# Altium schematic sheet CompensationRegression.SchDoc (part 1 of 2)
size 381 x 241 mm; SheetNumber: 1; SheetTotal: 1; SPICEModelCacheRULBCAFH: <root> / <DocumentId>RULBCAFH</DocumentId> / <CacheFrame Number="0"> / <Model Name="hpa_comphys" Kind="CKT"> / <Text>*$ / .SUBCKT HPA_COMPHYS INP INN OUT_OUT VDD VSS VHYS / EVMID VMID 0 VALUE = { ( V(VDD) + V(VSS) )/2 } / EVH VH 0 VALUE = { ( V(VHYS)/2) } / EINNNEW INNNEW 0 VALUE = { IF( ( V(OUT_OUT) &lt; V(VMID) ),(V(INN) + (V(VH))),( V(INN) - V(VH) ) ) } / EOUT OUT 0 VALUE = { IF( ( V(INP) &gt; V(INNNEW) ), V(VDD), V(VSS) ) } / R1 OUT OUT_OUT 1 / C1 OUT_OUT 0 1e-12 / .ENDS</Text> / </Model> / <Model Name="output_stage_smid" Kind="CKT"> / <Text>*$ / .subckt Output_Stage_SMID 1 2 3 4 / S_SMID         3 4 1 2 _SMID / RS_SMID         1 2 1G / .MODEL         _SMID VSWITCH Roff=1e12 Ron=1.0 Voff=1 Von=0 / .ends Output_Stage_SMID</Text> / </Model> / <Model Name="orgate" Kind="CKT"> / <Text>*$ / .SUBCKT ORGATE 1 2 3 VDD VSS / E1 4 0 VALUE = { IF( ((V(1)&lt; (V(VDD)+V(VSS))/2 ) &amp; (V(2)&lt; (V(VDD)+V(VSS))/2 )), V(VSS), V(VDD) ) } / R1 4 3 1 / C1 3 0 1e-12 / .ENDS</Text> / </Model> / <Model Name="diglevshift" Kind="CKT"> / <Text>*$ / .SUBCKT DIGLEVSHIFT 1 2 VDD_OLD VSS_OLD VDD_NEW VSS_NEW / *E1 3 0 VALUE = { IF( V(1) &lt; (V(VDD_OLD)+V(VSS_OLD))/2, V(VSS_NEW), V(VDD_NEW) ) } / E1 3 0 VALUE = { IF( V(1) &lt; 1, V(VSS_NEW), V(VDD_NEW) ) } / *$ / R1 3 2 1 / *C1 2 0 1e-12 / .ENDS</Text> / </Model> / <Model Name="4orgate" Kind="CKT"> / <Text>*$ / .SUBCKT 4ORGATE 1 2 3 4 5 VDD VSS / E1 6 0 VALUE = { IF( ((V(1)&gt; (V(VDD)+V(VSS))/2 ) ¦ (V(2)&gt; (V(VDD)+V(VSS))/2 ) ¦ (V(3)&gt; (V(VDD)+V(VSS))/2 ) ¦ (V(4)&gt; (V(VDD)+V(VSS))/2 )), V(VDD), V(VSS) ) } / R1 5 6 1 / .ENDS</Text> / </Model> / <Model Name="mid_supply" Kind="CKT"> / <Text>*$ / .SUBCKT MID_SUPPLY OUT VDD VSS / EVMID VMID 0 VALUE = { ( V(VDD) + V(VSS) )/2 } / EOUT OUT 0 VALUE = {V(VMID)} / .ENDS</Text> / </Model> / <Model Name="output_stage_shiz" Kind="CKT"> / <Text>*$ / .subckt Output_Stage_SHIZ 1 2 3 4 / S_SHIZ         3 4 1 2 _SHIZ / RS_SHIZ         1 2 1G / .MODEL         _SHIZ VSWITCH Roff=1e12 Ron=1.0 Voff=1 Von=0 / .ends Output_Stage_SHIZ</Text> / </Model> / <Model Name="inverter" Kind="CKT"> / <Text>*$ / .SUBCKT INVERTER 1 2 VDD VSS / E2 2 0 VALUE = { IF( V(1)&gt; (V(VDD)+V(VSS))/2, V(VSS), V(VDD) ) } / C1 1 0 1e-12 / .ENDS</Text> / </Model> / <Model Name="output_stage_svoh" Kind="CKT"> / <Text>*$ / .subckt Output_Stage_SVOH 1 2 3 4 / S_SVOH         3 4 1 2 _SVOH / RS_SVOH         1 2 1G / .MODEL         _SVOH VSWITCH Roff=1e12 Ron=1.0 Voff=0 Von=1 / .ends Output_Stage_SVOH</Text> / </Model> / <Model Name="output_stage_svol" Kind="CKT"> / <Text>*$ / .subckt Output_Stage_SVOL 1 2 3 4 / S_SVOL         3 4 1 2 _SVOL / RS_SVOL         1 2 1G / .MODEL         _SVOL VSWITCH Roff=1e12 Ron=1.0 Voff=1 Von=0 / .ends Output_Stage_SVOL</Text> / </Model> / <Model Name="andgate" Kind="CKT"> / <Text>*$ / .SUBCKT ANDGATE 1 2 3 VDD VSS / E1 4 0 VALUE = { IF( ((V(1)&gt; (V(VDD)+V(VSS))/2 ) &amp; (V(2)&gt; (V(VDD)+V(VSS))/2 )), V(VDD), V(VSS) ) } / R1 4 3 1 / C1 3 0 1e-12 / .ENDS</Text> / </Model> / <Model Name="output_stage" Kind="CKT"> / <Text>*$ / .SUBCKT Output_Stage EN IN_RANGE POR SHDN_CTRL V+ V+_BUFFER V- V-_BUFFER VIN / +  VOUT / X_SMID    CONTROL_MID 0 N778484 MID Output_Stage_SMID / X_U3         VIN DS_OUT V+_BUFFER V-_BUFFER V+ VSS_NEW DIGLEVSHIFT / X_U7         MID V+_BUFFER V-_BUFFER MID_SUPPLY / V_VLOGIC         1V 0 1 / V_V1         V+ VSS_NEW 1 / X_SHIZ    CONTROL_HIZ 0 N778484 N778496 Output_Stage_SHIZ / X_U8          POR IN_RANGE EN EN CONTROL_HIZ 1V 0 4ORGATE / X_U9         CONTROL_HIZ N789513 1V 0 INVERTER / X_U10         N789513 POR CONTROL_MID 1V 0 ORGATE / L_L1         N778484 VOUT  1n / C_COUTH         VOUT V+  9p   TC=0,0 / C_COUTL         V- VOUT  9p  TC=0,0 / X_SVOH    SOUT_CTRL VSS_NEW N8491902 V+ Output_Stage_SVOH / X_SVOL    SOUT_CTRL VSS_NEW V- N850209 Output_Stage_SVOL / R_ROUTH         N778496 N8491902  60 TC=0,0 / R_ROUTL         N850209 N778496  60 TC=0,0 / E_E1         N855577 VSS_NEW SHDN_CTRL 0 1 / X_U11         N855577 DS_OUT SOUT_CTRL V+ VSS_NEW ANDGATE / .ENDS</Text> / <Dependency>0\output_stage_smid</Dependency> / <Dependency>0\orgate</Dependency> / <Dependency>0\diglevshift</Dependency> / <Dependency>0\4orgate</Dependency> / <Dependency>0\mid_supply</Dependency> / <Dependency>0\output_stage_shiz</Dependency> / <Dependency>0\inverter</Dependency> / <Dependency>0\output_stage_svoh</Dependency> / <Dependency>0\output_stage_svol</Dependency> / <Dependency>0\andgate</Dependency> / </Model> / <Model Name="prop_delay" Kind="CKT"> / <Text>*$ / .SUBCKT Prop_Delay VIN VOUT / T_TPD         N03175 0 VOUT 0 Z0=50 TD=4.5n / R_RT         0 VOUT  50 TC=0,0 / R_RS         N03175 VIN  50 TC=0,0 / .ENDS</Text> / </Model> / <Model Name="vinrange_393" Kind="CKT"> / <Text>*$ / .SUBCKT VINRANGE_393 1 2 OUT VDD VSS / EOUT OUT2 0 VALUE = { IF( ( V(1) &gt;= V(2) ), V(VSS), V(VDD) ) } / R1 OUT2 OUT 1 / C1 OUT 0 1e-12 / .ENDS</Text> / </Model> / <Model Name="inputrange" Kind="CKT"> / <Text>*$ / .SUBCKT INPUTRANGE INN INP INRANGE V+_BUFFER V-_BUFFER / V_VCMNP         N20415 V-_BUFFER -0.21 / V_VCMPN         N202710 V+_BUFFER 0.21 / X_U1         N20155 INP N20826 V+_BUFFER V-_BUFFER VINRANGE_393 / V_VCMPP         N20155 V+_BUFFER 0.21 / V_VCMNN         N20539 V-_BUFFER -0.21 / X_U21         N202710 INN N20833 V+_BUFFER V-_BUFFER VINRANGE_393 / X_U22         INP N20415 N20840 V+_BUFFER V-_BUFFER VINRANGE_393 / X_U23         INN N20539 N20531 V+_BUFFER V-_BUFFER VINRANGE_393 / X_U24         N20826 N20833 N20840 N20531 INRANGE V+_BUFFER V-_BUFFER 4ORGATE / .ENDS</Text> / <Dependency>0\4orgate</Dependency> / <Dependency>0\vinrange_393</Dependency> / </Model> / <Model Name="vcc_range" Kind="CKT"> / <Text>*$ / .SUBCKT VCC_Range 1 2 OUT VDD VSS / EOUT OUT2 0 VALUE = { IF( ( V(1) &gt;= V(2) ), V(VDD), V(VSS) ) } / R1 OUT OUT2 1 / C1 OUT 0 1e-12 / .ENDS</Text> / </Model> / <Model Name="difference" Kind="CKT"> / <Text>*$ / .SUBCKT Difference 1 2 OUT VDD VSS / EOUT OUT1 0 VALUE = { V(1)- V(2)} / R1 OUT1 OUT 1 / *C1 OUT 0 1e-12 / .ENDS</Text> / </Model> / <Model Name="supply_enable" Kind="CKT"> / <Text>*$ / .SUBCKT Supply_Enable EN POR V+_BUFFER V-_BUFFER / X_U5         N16973 N20377 N777375 1V 0 VCC_Range / X_U15         N20310 N16973 POR 1V 0 VCC_Range / X_U13         V+_BUFFER V-_BUFFER N16973 1V 0 Difference / V_VS_MIN_SET         N20310 0 2.19 / V_VS_MAX_SET         N20377 V-_BUFFER 5.5 / V_VLOGIC         1V 0 1 / X_U16         N777122 N16973 N777182 1V 0 VCC_Range / V_VS_MIN_SET1         N777122 V-_BUFFER 2.19 / X_U17         N777375 N777182 EN 1V 0 ORGATE / .ENDS</Text> / <Dependency>0\vcc_range</Dependency> / <Dependency>0\difference</Dependency> / <Dependency>0\orgate</Dependency> / </Model> / <Model Name="supply_buffer1" Kind="CKT"> / <Text>*$ / .SUBCKT SUPPLY_BUFFER1 1 2 VDD_NEW VSS_NEW / EVDD_NEW VDD_NEW 0 VALUE = {V(1)} / EVSS_NEW VSS_NEW 0 VALUE = {V(2)} / .ENDS</Text> / </Model> / <Model Name="supply_buffer" Kind="CKT"> / <Text>*$ / .SUBCKT Supply_Buffer V+ V+_BUFFER V- V-_BUFFER / X_U1         V+ V- V+_BUFFER V-_BUFFER SUPPLY_BUFFER1 / .ENDS</Text> / <Dependency>0\supply_buffer1</Dependency> / </Model> / <Model Name="input_buffer" Kind="CKT"> / <Text>*$ / .SUBCKT Input_Buffer IN+ IN+_BUFF IN- IN-_BUFF / X_U1         IN+ IN- IN+_BUFF IN-_BUFF SUPPLY_BUFFER1 / .ENDS</Text> / <Dependency>0\supply_buffer1</Dependency> / </Model> / <Model Name="top_level_s1" Kind="CKT"> / <Text>*$ / .subckt Top_Level_S1 1 2 3 4 / S_S1         3 4 1 2 _S1 / RS_S1         1 2 1G / .MODEL         _S1 VSWITCH Roff=1e6 Ron=1.0 Voff=0 Von=1 / .ends Top_Level_S1</Text> / </Model> / <Model Name="top_level_s2" Kind="CKT"> / <Text>*$ / .subckt Top_Level_S2 1 2 3 4 / S_S2         3 4 1 2 _S2 / RS_S2         1 2 1G / .MODEL         _S2 VSWITCH Roff=1e6 Ron=1.0 Voff=1 Von=0 / .ends Top_Level_S2</Text> / </Model> / <Model Name="tlv3501" Kind="CKT"> / <Text>* TLV3501 / ***************************************************************************** / * (C) Copyright 2019 Texas Instruments Incorporated. All rights reserved. / ***************************************************************************** / ** This model is designed as an aid for customers of Texas Instruments. / ** TI and its licensors and suppliers make no warranties, either expressed / ** or implied, with respect to this model, including the warranties of / ** merchantability or fitness for a particular purpose.  The model is / ** provided solely on an "as is" basis.  The entire risk as to its quality / ** and performance is with the customer / ***************************************************************************** / * / * This model is subject to change without notice. Texas Instruments / * Incorporated is not responsible for updating this model. / * / ***************************************************************************** / * / * Released by: Texas Instruments Inc. / * Part: TLV3501 / * Date: 07/26/2021 / * Model Type:  TRANSIENT / * Simulator: PSpice / * Simulator Version: 17.4 / * Datasheet: SBOS321E Ã¢â‚¬â€œMARCH 2005Ã¢â‚¬â€œREVISED APRIL 2016 / * / ***************************************************************************** / * / * Updates: / * / * Version 1.0 : Release to Web / *         2.0 : Improving Model Specifications / * / ***************************************************************************** / * Notes: / * The following parameters are modeled: / * Iq, tpd, Ibias, Vcm, Vs, tr, tf, SHDN, Ishdn / * If the input or supply rail goes beyond the abs max limits, the output will float at mid supply / * If one or both inputs go beyond the commmon mode limit, the output will float at mid supply / * If the SHDN pin is above (V+)-0.9V, the comparator is disabled. If the SHDN pin is below (V+)-1.7V, the comparator is enabled. / * Modeled based off of typical EC table specs / ***************************************************************************** / * source TLV3501 / .SUBCKT TLV3501 IN+ IN- SHDN V+ V- OUT / X_U4 N21103 N865822 Prop_Delay / X_U2 IN-BUFF IN+BUFF INRANGE V+_BUFFER V-_BUFFER INPUTRANGE / X_U5 N21237 INRANGE 0 SHDN_CTRL V+ V+_BUFFER V- V-_BUFFER N865822 OUT / +  Output_Stage / X_U6 V+ V+_BUFFER V- V-_BUFFER Supply_Buffer / X_U3         N785573 IN-BUFF N21103 V+_BUFFER V-_BUFFER N852568 HPA_COMPHYS / X_U7 N21237 0 V+_BUFFER V-_BUFFER Supply_Enable / X_U1 IN+ IN+BUFF IN- IN-BUFF Input_Buffer / I_IBP         IN+ V- DC 2p / I_IBN         IN- V- DC 2p / V_VOS         N785573 IN+BUFF 1m / C_CINPL         V- IN+  0.5p  TC=0,0 / C_CINNL         V- IN-  0.5p  TC=0,0 / C_CINPH         IN+ V+  0.5p  TC=0,0 / C_CINNH         IN- V+  0.5p  TC=0,0 / X_U8         SHDN N858114 N858942 V+_BUFFER V-_BUFFER VINRANGE_393 / X_U9         N858423 SHDN N858660 V+_BUFFER V-_BUFFER VINRANGE_393 / V_EN_REF         N858114 V+_BUFFER -1.7 / V_HYST         N852568 0 6m / V_DIS_REF         N858423 V+_BUFFER -0.9 / X_U10         N861616 N861628 SHDN_CTRL 1V 0 ANDGATE / X_U11         N858660 N858664 V+_BUFFER 0 INVERTER / V_VLOGIC         1V 0 1 / T_TPD         N860089 0 N860095 0 Z0=50 TD=100n / R_RT         0 N860095  50 TC=0,0 / R_RS         N860089 N858942  50 TC=0,0 / T_TPD1         N860471 0 N860477 0 Z0=50 TD=30n / R_RS1         N860471 N858664  50 TC=0,0 / R_RT1         0 N860477  50 TC=0,0 / E_E1         N861616 0 N860095 0 2 / E_E2         N861628 0 N860477 0 2 / I_IB_SHDN         SHDN V- DC 2p / G_G1         N880795 V- N880935 0 1 / E_E4         N880765 0 1V SHDN_CTRL 2e-6 / R_RIS         N880795 V+  1u TC=0,0 / E_E3         N880755 0 SHDN_CTRL 0 3.2e-3 / X_S1    SHDN_CTRL 0 N880935 N880755 Top_Level_S1 / X_S2    SHDN_CTRL 0 N880935 N880765 Top_Level_S2 / V_V_LOGIC         N893768 0 1 / R_RIS1         N893768 1V  1u TC=0,0 / .ENDS</Text> / <Dependency>0\hpa_comphys</Dependency> / <Dependency>0\output_stage</Dependency> / <Dependency>0\prop_delay</Dependency> / <Dependency>0\inputrange</Dependency> / <Dependency>0\supply_enable</Dependency> / <Dependency>0\supply_buffer</Dependency> / <Dependency>0\input_buffer</Dependency> / <Dependency>0\vinrange_393</Dependency> / <Dependency>0\andgate</Dependency> / <Dependency>0\inverter</Dependency> / <Dependency>0\top_level_s1</Dependency> / <Dependency>0\top_level_s2</Dependency> / </Model> / <Model Name="block_dc_s7_ina819" Kind="CKT"> / <Text>* / .SUBCKT BLOCK_DC_S7_INA819 1 2 3 4 / .MODEL _S7 VSWITCH (ROFF=1E12 RON=50 VOFF=100M VON=500M) / RS_S7 1 2 1G / S_S7 3 4 1 2 _S7 / .ENDS BLOCK_DC_S7_INA819</Text> / </Model> / <Model Name="block_dc_s1_ina819" Kind="CKT"> / <Text>* / .SUBCKT BLOCK_DC_S1_INA819 1 2 3 4 / .MODEL _S1 VSWITCH (ROFF=1E12 RON=50 VOFF=100M VON=500M) / RS_S1 1 2 1G / S_S1 3 4 1 2 _S1 / .ENDS BLOCK_DC_S1_INA819</Text> / </Model> / <Model Name="block_dc_s5_ina819" Kind="CKT"> / <Text>* / .SUBCKT BLOCK_DC_S5_INA819 1 2 3 4 / .MODEL _S5 VSWITCH (ROFF=1E12 RON=50 VOFF=100M VON=500M) / RS_S5 1 2 1G / S_S5 3 4 1 2 _S5 / .ENDS BLOCK_DC_S5_INA819</Text> / </Model> / <Model Name="block_dc_s8_ina819" Kind="CKT"> / <Text>* / .SUBCKT BLOCK_DC_S8_INA819 1 2 3 4 / .MODEL _S8 VSWITCH (ROFF=1E12 RON=50 VOFF=100M VON=500M) / RS_S8 1 2 1G / S_S8 3 4 1 2 _S8 / .ENDS BLOCK_DC_S8_INA819</Text> / </Model> / <Model Name="block_dc_s6_ina819" Kind="CKT"> / <Text>* / .SUBCKT BLOCK_DC_S6_INA819 1 2 3 4 / .MODEL _S6 VSWITCH (ROFF=1E12 RON=50 VOFF=100M VON=500M) / RS_S6 1 2 1G / S_S6 3 4 1 2 _S6 / .ENDS BLOCK_DC_S6_INA819</Text> / </Model> / <Model Name="block_dc_s9_ina819" Kind="CKT"> / <Text>* / .SUBCKT BLOCK_DC_S9_INA819 1 2 3 4 / .MODEL _S9 VSWITCH (ROFF=1E12 RON=50 VOFF=100M VON=500M) / RS_S9 1 2 1G / S_S9 3 4 1 2 _S9 / .ENDS BLOCK_DC_S9_INA819</Text> / </Model> / <Model Name="block_dc_s10_ina819" Kind="CKT"> / <Text>* / .SUBCKT BLOCK_DC_S10_INA819 1 2 3 4 / .MODEL _S10 VSWITCH (ROFF=1E12 RON=50 VOFF=100M VON=500M) / RS_S10 1 2 1G / S_S10 3 4 1 2 _S10 / .ENDS BLOCK_DC_S10_INA819</Text> / </Model> / <Model Name="block_dc_s11_ina819" Kind="CKT"> / <Text>* / .SUBCKT BLOCK_DC_S11_INA819 1 2 3 4 / .MODEL _S11 VSWITCH (ROFF=1E12 RON=50 VOFF=100M VON=500M) / RS_S11 1 2 1G / S_S11 3 4 1 2 _S11 / .ENDS BLOCK_DC_S11_INA819</Text> / </Model> / <Model Name="block_dc_s12_ina819" Kind="CKT"> / <Text>* / .SUBCKT BLOCK_DC_S12_INA819 1 2 3 4 / .MODEL _S12 VSWITCH (ROFF=1E12 RON=50 VOFF=100M VON=500M) / RS_S12 1 2 1G / S_S12 3 4 1 2 _S12 / .ENDS BLOCK_DC_S12_INA819</Text> / </Model> / <Model Name="block_dc_s13_ina819" Kind="CKT"> / <Text>* / .SUBCKT BLOCK_DC_S13_INA819 1 2 3 4 / .MODEL _S13 VSWITCH (ROFF=1E12 RON=50 VOFF=100M VON=500M) / RS_S13 1 2 1G / S_S13 3 4 1 2 _S13 / .ENDS BLOCK_DC_S13_INA819</Text> / </Model> / <Model Name="block_dc_s14_ina819" Kind="CKT"> / <Text>* / .SUBCKT BLOCK_DC_S14_INA819 1 2 3 4 / .MODEL _S14 VSWITCH (ROFF=1E12 RON=50 VOFF=100M VON=500M) / RS_S14 1 2 1G / S_S14 3 4 1 2 _S14 / .ENDS BLOCK_DC_S14_INA819</Text> / </Model> / <Model Name="block_dc_s15_ina819" Kind="CKT"> / <Text>* / .SUBCKT BLOCK_DC_S15_INA819 1 2 3 4 / .MODEL _S15 VSWITCH (ROFF=1E12 RON=50 VOFF=100M VON=500M) / RS_S15 1 2 1G / S_S15 3 4 1 2 _S15 / .ENDS BLOCK_DC_S15_INA819</Text> / </Model> / <Model Name="a1_in_amp_u1_h1_ina819" Kind="CKT"> / <Text>* / .SUBCKT A1_IN_AMP_U1_H1_INA819 1 2 3 4 / H_U1_H1 3 4 VH_U1_H1 1K / VH_U1_H1 1 2 0V / .ENDS A1_IN_AMP_U1_H1_INA819</Text> / </Model> / <Model Name="vcm_clamp_ina819" Kind="CKT"> / <Text>* / .SUBCKT VCM_CLAMP_INA819 VIN+ VIN- IOUT- IOUT+ VP+ VP- PARAMS: GAIN=1 / G1 IOUT+ IOUT- VALUE={LIMIT(GAIN*V(VIN+,VIN-),V(VP-,VIN-),V(VP+,VIN-))} / .ENDS VCM_CLAMP_INA819</Text> / </Model> / <Model Name="iq_src_ina819" Kind="CKT"> / <Text>* / .SUBCKT IQ_SRC_INA819 VC+ VC- IOUT+ IOUT- PARAMS: GAIN=1E-3 / G1 IOUT+ IOUT- VALUE={IF((V(VC+,VC-)&lt;=0),0,GAIN*V(VC+,VC-))} / .ENDS IQ_SRC_INA819</Text> / </Model> / <Model Name="aol_1_ina819" Kind="CKT"> / <Text>* / .SUBCKT AOL_1_INA819 VC+ VC- IOUT+ IOUT- PARAMS: GAIN=1E-4 IPOS=.5 INEG=-.5 / G1 IOUT+ IOUT- VALUE={LIMIT(GAIN*V(VC+,VC-),INEG,IPOS)} / .ENDS AOL_1_INA819</Text> / </Model> / <Model Name="aol_2_in_ina819" Kind="CKT"> / <Text>* / .SUBCKT AOL_2_IN_INA819 VC+ VC- IOUT+ IOUT- PARAMS: GAIN=0.1234 IPOS=10 INEG=-10 / G1 IOUT+ IOUT- VALUE={LIMIT(GAIN*V(VC+,VC-),INEG,IPOS)} / .ENDS AOL_2_IN_INA819</Text> / </Model> / <Model Name="cl_src_ina819" Kind="CKT"> / <Text>* / .SUBCKT CL_SRC_INA819 VC+ VC- IOUT+ IOUT- PARAMS: GAIN=1 IPOS=0.246 INEG=-0.246 / G1 IOUT+ IOUT- VALUE={LIMIT(GAIN*V(VC+,VC-),INEG,IPOS)} / .ENDS CL_SRC_INA819</Text> / </Model> / <Model Name="a2_in_amp_u2_h1_ina819" Kind="CKT"> / <Text>* / .SUBCKT A2_IN_AMP_U2_H1_INA819 1 2 3 4 / H_U2_H1 3 4 VH_U2_H1 1K / VH_U2_H1 1 2 0V / .ENDS A2_IN_AMP_U2_H1_INA819</Text> / </Model> / <Model Name="vnse_ina819" Kind="CKT"> / <Text>* / .SUBCKT VNSE_INA819 1 2 / .PARAM FLW=0.11 / .PARAM GLF={PWR(FLW,0.25)*NLF/1164} / .PARAM NLF=250 / .PARAM NVR=29 / .PARAM RNV={1.184*PWR(NVR,2)} / .MODEL DVN D (KF={PWR(FLW,0.5)/1E11} IS=1.0E-16) / D1 7 0 DVN / D2 8 0 DVN / E1 3 6 7 8 {GLF} / E2 6 4 5 0 10 / E3 1 2 3 4 1 / I1 0 7 10E-3 / I2 0 8 10E-3 / R1 3 0 1E9 / R2 3 0 1E9 / R3 3 6 1E9 / R4 5 0 {RNV} / R5 5 0 {RNV} / R6 3 4 1E9 / R7 4 0 1E9 / .ENDS VNSE_INA819</Text> / </Model> / <Model Name="out_amp_u3_h1_ina819" Kind="CKT"> / <Text>* / .SUBCKT OUT_AMP_U3_H1_INA819 1 2 3 4 / H_U3_H1 3 4 VH_U3_H1 1K / VH_U3_H1 1 2 0V / .ENDS OUT_AMP_U3_H1_INA819</Text> / </Model> / <Model Name="out_amp_u3_h4_ina819" Kind="CKT"> / <Text>* / .SUBCKT OUT_AMP_U3_H4_INA819 1 2 3 4 / H_U3_H4 3 4 VH_U3_H4 -1 / VH_U3_H4 1 2 0V / .ENDS OUT_AMP_U3_H4_INA819</Text> / </Model> / <Model Name="out_amp_u3_h5_ina819" Kind="CKT"> / <Text>* / .SUBCKT OUT_AMP_U3_H5_INA819 1 2 3 4 / H_U3_H5 3 4 VH_U3_H5 1 / VH_U3_H5 1 2 0V / .ENDS OUT_AMP_U3_H5_INA819</Text> / </Model> / <Model Name="out_amp_u3_s3_ina819" Kind="CKT"> / <Text>* / .SUBCKT OUT_AMP_U3_S3_INA819 1 2 3 4 / .MODEL _U3_S3 VSWITCH (ROFF=1E9 RON=10M VOFF=0.0V VON=10MV) / RS_U3_S3 1 2 1G / S_U3_S3 3 4 1 2 _U3_S3 / .ENDS OUT_AMP_U3_S3_INA819</Text> / </Model> / <Model Name="out_amp_u3_s4_ina819" Kind="CKT"> / <Text>* / .SUBCKT OUT_AMP_U3_S4_INA819 1 2 3 4 / .MODEL _U3_S4 VSWITCH (ROFF=1E9 RON=10M VOFF=0.0V VON=10MV) / RS_U3_S4 1 2 1G / S_U3_S4 3 4 1 2 _U3_S4 / .ENDS OUT_AMP_U3_S4_INA819</Text> / </Model> / <Model Name="clawn_ina819" Kind="CKT"> / <Text>* / .SUBCKT CLAWN_INA819 VC+ VC- IOUT+ IOUT- / G1 IOUT+ IOUT- TABLE {(V(VC+,VC-))} =(0, 2E-5)(10, 2.75E-4)(14, 4.46E-4)(15, 6.03E-4)(16, 9.41E-4)(17, 1.52E-3)(17.5, / + 1.92E-3)(18, 2.41E-3) / .ENDS CLAWN_INA819</Text> / </Model> / <Model Name="vos_drift_ina819" Kind="CKT"> / <Text>* / .SUBCKT VOS_DRIFT_INA819 VOS+ VOS- PARAMS: DC=10.09E-06 POL=1 DRIFT=2.5E-6 / E1 VOS+ VOS- VALUE={DC+POL*DRIFT*(TEMP-27)} / .ENDS VOS_DRIFT_INA819</Text> / </Model> / <Model Name="clamp_amp_lo_ina819" Kind="CKT"> / <Text>* / .SUBCKT CLAMP_AMP_LO_INA819 VC+ VC- VIN COM VO+ VO- PARAMS: G=1 / GVO- COM VO- VALUE = {IF(V(VIN,COM)&lt;V(VC-,COM),((V(VC-,COM)-V(VIN,COM))*G),0)} / GVO+ COM VO+ VALUE = {IF(V(VIN,COM)&gt;V(VC+,COM),((V(VIN,COM)-V(VC+,COM))*G),0)} / .ENDS CLAMP_AMP_LO_INA819</Text> / </Model> / <Model Name="clamp_amp_hi_ina819" Kind="CKT"> / <Text>* / .SUBCKT CLAMP_AMP_HI_INA819 VC+ VC- VIN COM VO+ VO- PARAMS: G=10 / GVO- COM VO- VALUE = {IF(V(VIN,COM)&lt;V(VC-,COM),((V(VC-,COM)-V(VIN,COM))*G),0)} / GVO+ COM VO+ VALUE = {IF(V(VIN,COM)&gt;V(VC+,COM),((V(VIN,COM)-V(VC+,COM))*G),0)} / .ENDS CLAMP_AMP_HI_INA819</Text> / </Model> / <Model Name="ol_sense_ina819" Kind="CKT"> / <Text>* / .SUBCKT OL_SENSE_INA819 1 2 3 4 / GSW+ 1 2 VALUE = {IF((V(3,1)&gt;10E-3¦V(4,1)&gt;10E-3),1,0)} / .ENDS OL_SENSE_INA819</Text> / </Model> / <Model Name="clawp_ina819" Kind="CKT"> / <Text>* / .SUBCKT CLAWP_INA819 VC+ VC- IOUT+ IOUT- / G1 IOUT+ IOUT- TABLE {(V(VC+,VC-))} =(0, 1.5E-4)(10, 4.15E-4)(12, 5.6E-4)(13, 7.17E-4)(14, 9.77E-4)(15, 1.25E-3)(16, / + 1.62E-3)(17, 2.19E-3)(17.5, 2.66E-3)(18, 3.46E-3) / .ENDS CLAWP_INA819</Text> / </Model> / <Model Name="gr_src_ina819" Kind="CKT"> / <Text>* / .SUBCKT GR_SRC_INA819 VC+ VC- IOUT+ IOUT- PARAMS: GAIN=1 IPOS=1.18 INEG=-1.18 / G1 IOUT+ IOUT- VALUE={LIMIT(GAIN*V(VC+,VC-),INEG,IPOS)} / .ENDS GR_SRC_INA819</Text> / </Model> / <Model Name="sw_ol_ina819" Kind="CKT"> / <Text>* / .SUBCKT SW_OL_INA819 SW_OL MID CAP_L CAP_R / .MODEL OL_SW VSWITCH (RON=1E-3 ROFF=1E9 VON=900E-3 VOFF=800E-3) / S1 CAP_L CAP_R SW_OL MID OL_SW / .ENDS SW_OL_INA819</Text> / </Model> / <Model Name="vos_drift_in_ina819" Kind="CKT"> / <Text>* / .SUBCKT VOS_DRIFT_IN_INA819 VOS+ VOS- PARAMS: DC=10.09E-06 POL=1 DRIFT=0.4E-6 / E1 VOS+ VOS- VALUE={DC+POL*DRIFT*(TEMP-27)} / .ENDS VOS_DRIFT_IN_INA819</Text> / </Model> / <Model Name="aol_2_ina819" Kind="CKT"> / <Text>* / .SUBCKT AOL_2_INA819 VC+ VC- IOUT+ IOUT- PARAMS: GAIN=0.1234 IPOS=0.59 INEG=-0.59 / G1 IOUT+ IOUT- VALUE={LIMIT(GAIN*V(VC+,VC-),INEG,IPOS)} / .ENDS AOL_2_INA819</Text> / </Model> / <Model Name="zo_src_ina819" Kind="CKT"> / <Text>* / .SUBCKT ZO_SRC_INA819 VC+ VC- IOUT+ IOUT- PARAMS: GAIN=11764.7 IPOS=3.6E3 INEG=-3.6E3 / G1 IOUT+ IOUT- VALUE={LIMIT(GAIN*V(VC+,VC-),INEG,IPOS)} / .ENDS ZO_SRC_INA819</Text> / </Model> / <Model Name="claw_src_ina819" Kind="CKT"> / <Text>* / .SUBCKT CLAW_SRC_INA819 VC+ VC- IOUT+ IOUT- PARAMS: GAIN=1 IPOS=0.123 INEG=-0.123 / G1 IOUT+ IOUT- VALUE={LIMIT(GAIN*V(VC+,VC-),INEG,IPOS)} / .ENDS CLAW_SRC_INA819</Text> / </Model> / <Model Name="gain_sense_ina819" Kind="CKT"> / <Text>* / .SUBCKT GAIN_SENSE_INA819 COM VOUT VIN GAIN / G1 COM GAIN VALUE = {MAX((V(VOUT,COM)/V(VIN,COM))-5,0)} / .ENDS GAIN_SENSE_INA819</Text> / </Model> / <Model Name="vnse_in_ina819" Kind="CKT"> / <Text>* / .SUBCKT VNSE_IN_INA819 1 2 / .PARAM FLW=0.11 / .PARAM GLF={PWR(FLW,0.25)*NLF/1164} / .PARAM NLF=14 / .PARAM NVR=7 / .PARAM RNV={1.184*PWR(NVR,2)} / .MODEL DVN D (KF={PWR(FLW,0.5)/1E11} IS=1.0E-16) / D1 7 0 DVN / D2 8 0 DVN / E1 3 6 7 8 {GLF} / E2 6 4 5 0 10 / E3 1 2 3 4 1 / I1 0 7 10E-3 / I2 0 8 10E-3 / R1 3 0 1E9 / R2 3 0 1E9 / R3 3 6 1E9 / R4 5 0 {RNV} / R5 5 0 {RNV} / R6 3 4 1E9 / R7 4 0 1E9 / .ENDS VNSE_IN_INA819</Text> / </Model> / <Model Name="r_cmrr_ina819" Kind="CKT"> / <Text>* / .SUBCKT R_CMRR_INA819 GAIN COM R1 R2 / ERES R1 1 VALUE = {I(VSENSE)*V(2,COM)} / ETABLE 2 COM TABLE {V(GAIN,COM)} =(0, 0.8)(500, 0.8)(1000, 4.5)(2000, 9)(5000, 22.5) / VSENSE 1 R2 DC 0 / .ENDS R_CMRR_INA819</Text> / </Model> / <Model Name="femt_ina819" Kind="CKT"> / <Text>* / .SUBCKT FEMT_INA819 1 2 / .PARAM FLWF=0.11 / .PARAM GLFF={PWR(FLWF,0.25)*NLFF/1164} / .PARAM NLFF=659 / .PARAM NVRF=130 / .PARAM RNVF={1.184*PWR(NVRF,2)} / .MODEL DVNF D (KF={PWR(FLWF,0.5)/1E11} IS=1.0E-16) / D1 7 0 DVNF / D2 8 0 DVNF / E1 3 6 7 8 {GLFF} / E2 6 4 5 0 10 / G1 1 2 3 4 1E-6 / I1 0 7 10E-3 / I2 0 8 10E-3 / R1 3 0 1E9 / R2 3 0 1E9 / R3 3 6 1E9 / R4 5 0 {RNVF} / R5 5 0 {RNVF} / R6 3 4 1E9 / R7 4 0 1E9 / .ENDS FEMT_INA819</Text> / </Model> / <Model Name="ina819" Kind="CKT"> / <Text>*$ / * INA819 / ***************************************************************************** / * (C) Copyright 2023 Texas Instruments Incorporated. All rights reserved. / ***************************************************************************** / ** This model is designed as an aid for customers of Texas Instruments. / ** TI and its licensors and suppliers make no warranties, either expressed / ** or implied, with respect to this model, including the warranties of / ** merchantability or fitness for a particular purpose.  The model is / ** provided solely on an "as is" basis.  The entire risk as to its quality / ** and performance is with the customer / ***************************************************************************** / * / * This model is subject to change without notice. Texas Instruments / * Incorporated is not responsible for updating this model. / * / ***************************************************************************** / * / ** Released by: Online Design Tools, Texas Instruments Inc. / * Part: INA819 / * Date: 27MAR2023 / * Model Type: Generic (suitable for all analysis types) / * EVM Order Number: N/A / * EVM Users Guide:  N/A / * Datasheet: SBOS959D - DECEMBER 2018 - REVISED APRIL 2022 / * Created with Green-Williams-Lis Op Amp Macro-model Architecture / * / * Model Version: Final 1.2 / * / ***************************************************************************** / * / * Updates: / * / * Final 1.2 / * Updated VCM block in differential amplifier. / * / * Final 1.1 / * 1. Updated PSpice symbol. / * 2. Modified the capacitor(C_C14) value from 1F to 4uF in GND Float-IQ block / *    to resolve the convergence issue in single and asymmetric supply test. / * / * Final 1.0 / * Release to Web. / * / ***************************************************************************** / * Model Usage Notes: / * 1. The following parameters are modeled: / *    a. OPEN-LOOP GAIN AND PHASE VS. FREQUENCY  WITH RL, CL EFFECTS (Aol) / *    b. UNITY GAIN BANDWIDTH (GBW) / *    c. INPUT COMMON-MODE REJECTION RATIO VS. FREQUENCY (CMRR) / *    d. POWER SUPPLY REJECTION RATIO VS. FREQUENCY (PSRR) / *    e. DIFFERENTIAL INPUT IMPEDANCE (Zid) / *    f. COMMON-MODE INPUT IMPEDANCE (Zic) / *    g. OPEN-LOOP OUTPUT IMPEDANCE VS. FREQUENCY (Zo) / *    h. OUTPUT CURRENT THROUGH THE SUPPLY (Iout) / *    i. INPUT VOLTAGE NOISE DENSITY VS. FREQUENCY (en) / *    j. INPUT CURRENT NOISE DENSITY VS. FREQUENCY (in) / *    k. OUTPUT VOLTAGE SWING vs. OUTPUT CURRENT (Vo) / *    l. SHORT-CIRCUIT OUTPUT CURRENT (Isc) / *    m. QUIESCENT CURRENT (Iq) / *    n. SETTLING TIME VS. CAPACITIVE LOAD (ts) / *    o. SLEW RATE (SR) / *    p. SMALL SIGNAL OVERSHOOT VS. CAPACITIVE LOAD / *    q. LARGE SIGNAL RESPONSE / *    r. OVERLOAD RECOVERY TIME (tor) / *    s. INPUT BIAS CURRENT (Ib) / *    t. INPUT OFFSET CURRENT (Ios) / *    u. INPUT OFFSET VOLTAGE (Vos) / *    v. INPUT OFFSET VOLTAGE VS. TEMPERATURE (Vos Drift) / *    w. INPUT COMMON-MODE VOLTAGE RANGE (Vcm) / *    x. INPUT OFFSET VOLTAGE VS. INPUT COMMON-MODE VOLTAGE (Vos vs. Vcm) / *    y. INPUT/OUTPUT ESD CELLS (ESDin, ESDout) / ***************************************************************************** / .SUBCKT INA819 IN+ IN- VCC VEE OUT REF RG+ RG- / ***************************************************************************** / C_C_COM0     N359954 MID 4P / C_C_COM1     MID N360124 4P / C_C_DIFF     N360124 N359954 1P / C_C_F1       N373869 N373721 57F / C_C_F2       REF N375419 1F / C_C4         INP MID 1F / C_C5         INN MID 1F / C_C6         N365868 NODE1 3.5P / C_C7         N365907 NODE2 3.5P / C_C13        0 N370480 1F / C_C14        0 N370348 4U / C_C15        0 N370520 1F / C_U1_C2      MID U1_N920148 35.4F / C_U1_C10     U1_N945870 U1_N945880 15.92N / C_U1_C11     MID U1_N946838 3.316F / C_U1_C21     U1_N918081 MID 1.45U / C_U1_C29     U1_VIMON1 MID 1N / C_U1_C30     MID U1_N955005 15.9F / C_U1_C31     MID U1_N927180 15.9F / C_U1_C32     MID U1_N957771 2.122E-16 / C_U1_C33     MID U1_N959671 2.122E-16 / C_U1_C34     U1_N959635 U1_N960387 1.477E-16 / C_U2_C2      MID U2_N920148 35.4F / C_U2_C10     U2_N945870 U2_N945880 15.92N / C_U2_C11     MID U2_N946838 3.316F / C_U2_C21     U2_N918081 MID 1.46U / C_U2_C29     U2_VIMON2 MID 1N / C_U2_C30     MID U2_N955005 15.9F / C_U2_C31     MID U2_N927180 15.9F / C_U2_C32     MID U2_N957771 2.122E-16 / C_U2_C33     MID U2_N959671 2.122E-16 / C_U2_C34     U2_N959635 U2_N960387 1.477E-16 / C_U3_C_DIFF  U3_N23574 U3_N23567 2P / C_U3_C2      U3_N25921 U3_N25929 227N / C_U3_C3      U3_N27785 U3_N27793 29N / C_U3_C4      U3_N32347 MID 1F / C_U3_C5      U3_CLAMP3 MID 633N / C_U3_C10     U3_N37029 U3_N37037 4.75N / C_U3_C11     MID U3_N39473 6.77F / C_U3_C12     U3_N546017 U3_N39892 1.872E-16 / C_U3_C16     MID U3_N56849 1F / C_U3_C17     MID U3_N57325 1F / C_U3_C18     MID U3_N59747 1F / C_U3_C19     MID U3_N59865 1F / C_U3_C20     MID U3_N65579 1F / C_U3_C21     MID U3_N65697 1F / C_U3_C22     MID U3_N68774 1F / C_U3_C23     U3_N72398 MID 1F / C_U3_C24     MID U3_N72391 1F / C_U3_C25     MID U3_N81574 1P / C_U3_C26     MID U3_N81664 1P / C_U3_C27     MID U3_SW_OL3 1P / C_U3_C28     U3_VCLP3 MID 1N / C_U3_C29     U3_VIMON3 MID 1N / C_U3_C30     U3_VOUT_S3 MID 1N / C_U3_C31     MID U3_N542865 7.96E-17 / C_U3_C32     MID U3_N546055 7.96E-17 / E_E1         N474241 0 N370348 0 1 / E_U3_E2      U3_N158495 MID U3_CL_CLAMP3 MID 1 / E_U3_E3      U3_N161937 MID N373869 MID 1 / G_G1         N365868 RG- INN RG- 1.33M / G_G3         N365907 RG+ INP RG+ 1.33M / G_G18        VCC_B 0 VCC 0 -1 / G_G19        VEE_B 0 VEE 0 -1 / G_G20        N372587 MID INP INN -1 / G_U1_G15     U1_N945870 MID U1_N927180 U1_N234424 -88.496 / G_U1_G16     U1_N946178 MID U1_N945880 MID -18 / G_U1_G17     U1_N946216 MID U1_N946196 MID -1 / G_U1_G54     U1_N920148 MID U1_N918081 MID -1E-6 / G_U1_G55     U1_N955005 MID U1_N920148 MID -1E-6 / G_U1_G56     U1_N927180 MID U1_N955005 MID -1E-6 / G_U1_G57     U1_N957735 MID U1_N957719 MID -1 / G_U1_G58     U1_N959635 MID U1_N959619 MID -1 / G_U1_G59     U1_N960435 MID U1_N960387 MID -9.09091K / G_U2_G15     U2_N945870 MID U2_N927180 U2_N234424 -88.496 / G_U2_G16     U2_N946178 MID U2_N945880 MID -18 / G_U2_G17     U2_N946216 MID U2_N946196 MID -1 / G_U2_G54     U2_N920148 MID U2_N918081 MID -1E-6 / G_U2_G55     U2_N955005 MID U2_N920148 MID -1E-6 / G_U2_G56     U2_N927180 MID U2_N955005 MID -1E-6 / G_U2_G57     U2_N957735 MID U2_N957719 MID -1 / G_U2_G58     U2_N959635 MID U2_N959619 MID -1 / G_U2_G59     U2_N960435 MID U2_N960387 MID -9.09091K / G_U3_G3      U3_N25921 MID VEE_B MID -350M / G_U3_G4      U3_N27785 MID VCC_B MID -912M / G_U3_G5      U3_N28678 U3_N28438 U3_N27793 U3_N25929 -1M / G_U3_G6      U3_VSENSE3 MID U3_CLAMP3 MID -1M / G_U3_G12     U3_CLAW_CLAMP3 MID U3_VSENSE3 MID -1M / G_U3_G13     U3_CL_CLAMP3 MID U3_CLAW_CLAMP3 MID -1M / G_U3_G15     U3_N37029 MID U3_CL_CLAMP3 U3_N45999 -88.5 / G_U3_G16     U3_N39124 MID U3_N37037 MID -6.866 / G_U3_G17     U3_N39920 MID U3_N39417 MID -1 / G_U3_G20     U3_VCC_CLP3 MID U3_N72398 MID -1M / G_U3_G21     U3_VEE_CLP3 MID U3_N72391 MID -1M / G_U3_G24     U3_N542853 MID U3_N542815 MID -1 / G_U3_G25     U3_N546017 MID U3_N546001 MID -1 / G_U3_G26     U3_N1017618 MID U3_N1017606 MID -1 / G_U3_G27     U3_N1017680 MID U3_N1017700 MID -1 / I_I_B        N359958 MID DC 150P / I_I_OS       N360200 MID DC 1F / I_I_Q        VCC VEE DC 350U / I_ISINK1     RG- VEE_B DC 24U / I_ISINK2     RG+ VEE_B DC 24U / R_R1         IN+ N359954 R_NOISELESS 10M / R_R2         IN- N360124 R_NOISELESS 10M / R_R3         N359954 MID R_NOISELESS 1T / R_R4         MID N360124 R_NOISELESS 1T / R_R15        N363177 N359958 R_NOISELESS 1M / R_R16        N364506 N360200 R_NOISELESS 1M / R_R18        MID N363059 R_NOISELESS 1G / R_R19        MID N363261 R_NOISELESS 1G / R_R20        N363141 MID R_NOISELESS 1 / R_R21        INP N363141 R_NOISELESS 1M / R_R22        MID N364388 R_NOISELESS 1G / R_R23        INN N364470 R_NOISELESS 1M / R_R24        N364470 MID R_NOISELESS 1 / R_R25        MID N364590 R_NOISELESS 1G / R_R46        VCC_B 0 R_NOISELESS 1 / R_R47        VCC_B N370480 R_NOISELESS 1M / R_R48        N370480 N370348 R_NOISELESS 1MEG / R_R49        N370348 0 R_NOISELESS 1T / R_R50        N370348 N370520 R_NOISELESS 1MEG / R_R51        N370520 VEE_B R_NOISELESS 1M / R_R52        VEE_B 0 R_NOISELESS 1 / R_R53        N372587 MID R_NOISELESS 1 / R_R54        GAIN_S MID R_NOISELESS 1 / R_R60        N365868 VCC_B 41.67K / R_R61        N365907 VCC_B 41.67K / R_R62        RG+ NODE2 25K / R_R63        RG- NODE1 25K / R_R64        N373721 NODE1 40K / R_R65        N373869 N373721 40K / R_R66        N375419 NODE2 40K / R_R67        N375473 N375419 40K / R_R68        OUT N373869 10M / R_R69        MID N474241 R_NOISELESS 10M / R_U1_R34     U1_N945880 U1_N945870 R_NOISELESS 100MEG / R_U1_R35     MID U1_N945870 R_NOISELESS 1 / R_U1_R36     MID U1_N945880 R_NOISELESS 5.882MEG / R_U1_R38     U1_N946196 U1_N946178 R_NOISELESS 627.3MEG / R_U1_R39     U1_N946838 U1_N946196 R_NOISELESS 100MEG / R_U1_R41     MID U1_N946216 R_NOISELESS 1 / R_U1_R46     MID U1_N946178 R_NOISELESS 1 / R_U1_R67     MID U1_N918063 R_NOISELESS 1E6 / R_U1_R68     MID U1_N918081 R_NOISELESS 1E6 / R_U1_R135    U1_N920148 MID R_NOISELESS 1E6 / R_U1_R148    U1_N955005 MID R_NOISELESS 1E6 / R_U1_R149    U1_N927180 MID R_NOISELESS 1E6 / R_U1_R150    U1_N957719 U1_N946216 R_NOISELESS 271.3MEG / R_U1_R151    U1_N957771 U1_N957719 R_NOISELESS 100MEG / R_U1_R152    MID U1_N957735 R_NOISELESS 1 / R_U1_R153    U1_N959619 U1_N957735 R_NOISELESS 271.3MEG / R_U1_R154    U1_N959671 U1_N959619 R_NOISELESS 100MEG / R_U1_R155    MID U1_N959635 R_NOISELESS 1 / R_U1_R156    U1_N960387 U1_N959635 R_NOISELESS 100MEG / R_U1_R157    MID U1_N960435 R_NOISELESS 1 / R_U1_R158    MID U1_N960387 R_NOISELESS 11.0012K / R_U1_RDUMMY1 MID U1_N234424 R_NOISELESS 10K / R_U1_RX1     U1_N234424 U1_N960435 R_NOISELESS 100K / R_U1_RX2     U1_VIMON1 U1_N963303 R_NOISELESS 100 / R_U1_RX3     MID U1_N963303 R_NOISELESS 1G / R_U2_R34     U2_N945880 U2_N945870 R_NOISELESS 100MEG / R_U2_R35     MID U2_N945870 R_NOISELESS 1 / R_U2_R36     MID U2_N945880 R_NOISELESS 5.882MEG / R_U2_R38     U2_N946196 U2_N946178 R_NOISELESS 627.3MEG / R_U2_R39     U2_N946838 U2_N946196 R_NOISELESS 100MEG / R_U2_R41     MID U2_N946216 R_NOISELESS 1 / R_U2_R46     MID U2_N946178 R_NOISELESS 1 / R_U2_R67     MID U2_N971041 R_NOISELESS 1E6 / R_U2_R68     MID U2_N918081 R_NOISELESS 1E6 / R_U2_R135    U2_N920148 MID R_NOISELESS 1E6 / R_U2_R148    U2_N955005 MID R_NOISELESS 1E6 / R_U2_R149    U2_N927180 MID R_NOISELESS 1E6 / R_U2_R150    U2_N957719 U2_N946216 R_NOISELESS 271.3MEG / R_U2_R151    U2_N957771 U2_N957719 R_NOISELESS 100MEG / R_U2_R152    MID U2_N957735 R_NOISELESS 1 / R_U2_R153    U2_N959619 U2_N957735 R_NOISELESS 271.3MEG / R_U2_R154    U2_N959671 U2_N959619 R_NOISELESS 100MEG / R_U2_R155    MID U2_N959635 R_NOISELESS 1 / R_U2_R156    U2_N960387 U2_N959635 R_NOISELESS 100MEG / R_U2_R157    MID U2_N960435 R_NOISELESS 1 / R_U2_R158    MID U2_N960387 R_NOISELESS 11.0012K / R_U2_RDUMMY1 MID U2_N234424 R_NOISELESS 10K / R_U2_RX1     U2_N234424 U2_N960435 R_NOISELESS 100K / R_U2_RX2     U2_VIMON2 U2_N963303 R_NOISELESS 100 / R_U2_RX3     MID U2_N963303 R_NOISELESS 1G / R_U3_R1      N375419 U3_N23567 R_NOISELESS 10M / R_U3_R2      N373721 U3_N23574 R_NOISELESS 10M / R_U3_R3      U3_N23567 MID R_NOISELESS 1T / R_U3_R4      MID U3_N23574 R_NOISELESS 1T / R_U3_R9      U3_N25929 U3_N25921 R_NOISELESS 1MEG / R_U3_R10     MID U3_N25921 R_NOISELESS 1 / R_U3_R11     MID U3_N25929 R_NOISELESS 1.42857 / R_U3_R12     U3_N27793 U3_N27785 R_NOISELESS 1MEG / R_U3_R13     MID U3_N27785 R_NOISELESS 1 / R_U3_R14     MID U3_N27793 R_NOISELESS 548M / R_U3_R15     U3_N28438 U3_N25435 R_NOISELESS 1M / R_U3_R16     U3_N28678 U3_N28438 R_NOISELESS 1K / R_U3_R17     U3_N31303 U3_N23574 R_NOISELESS 1M / R_U3_R18     MID U3_N31389 R_NOISELESS 1G / R_U3_R19     MID U3_N31737 R_NOISELESS 1G / R_U3_R20     U3_N32236 MID R_NOISELESS 1 / R_U3_R21     U3_N32347 U3_N32236 R_NOISELESS 1M / R_U3_R22     MID U3_N32510 R_NOISELESS 1MEG / R_U3_R23     MID U3_CLAMP3 R_NOISELESS 1MEG / R_U3_R24     MID U3_VSENSE3 R_NOISELESS 1K / R_U3_R32     MID U3_CLAW_CLAMP3 R_NOISELESS 1K / R_U3_R33     MID U3_CL_CLAMP3 R_NOISELESS 1K / R_U3_R34     U3_N37037 U3_N37029 R_NOISELESS 100MEG / R_U3_R35     MID U3_N37029 R_NOISELESS 1 / R_U3_R36     MID U3_N37037 R_NOISELESS 17.05MEG / R_U3_R37     MID U3_N39124 R_NOISELESS 1 / R_U3_R38     U3_N39417 U3_N39124 R_NOISELESS 147MEG / R_U3_R39     U3_N39473 U3_N39417 R_NOISELESS 100MEG / R_U3_R40     U3_N39892 U3_N546017 R_NOISELESS 100MEG / R_U3_R41     MID U3_N39920 R_NOISELESS 1 / R_U3_R42     MID U3_N39892 R_NOISELESS 8.50072K / R_U3_R43     MID U3_N46041 R_NOISELESS 1 / R_U3_R53     U3_VCC_CLP3 MID R_NOISELESS 1G / R_U3_R54     U3_N55560 MID R_NOISELESS 1 / R_U3_R55     U3_N56849 U3_N55560 R_NOISELESS 1M / R_U3_R56     U3_VEE_CLP3 MID R_NOISELESS 1G / R_U3_R57     U3_N57321 MID R_NOISELESS 1 / R_U3_R58     U3_N57325 U3_N57321 R_NOISELESS 1M / R_U3_R59     U3_N59739 MID R_NOISELESS 1G / R_U3_R60     U3_N59743 MID R_NOISELESS 1 / R_U3_R61     U3_N59747 U3_N59743 R_NOISELESS 1M / R_U3_R62     U3_N59865 U3_N59881 R_NOISELESS 1M / R_U3_R63     U3_N59905 MID R_NOISELESS 1G / R_U3_R64     U3_N59881 MID R_NOISELESS 1 / R_U3_R65     U3_N65567 MID R_NOISELESS 1G / R_U3_R66     U3_N65575 MID R_NOISELESS 1 / R_U3_R67     U3_N65579 U3_N65575 R_NOISELESS 1M / R_U3_R68     U3_N65697 U3_N65713 R_NOISELESS 1M / R_U3_R69     U3_N65737 MID R_NOISELESS 1G / R_U3_R70     U3_N65713 MID R_NOISELESS 1 / R_U3_R71     U3_N68774 U3_VSENSE3 R_NOISELESS 1M / R_U3_R72     VCC_B U3_N72064 R_NOISELESS 1K / R_U3_R73     U3_N72064 U3_N72398 R_NOISELESS 1M / R_U3_R74     U3_N72073 VEE_B R_NOISELESS 1K / R_U3_R75     U3_N72073 U3_N72391 R_NOISELESS 1M / R_U3_R76     MID U3_VCC_CLP3 R_NOISELESS 1K / R_U3_R77     U3_VEE_CLP3 MID R_NOISELESS 1K / R_U3_R80     U3_V11 U3_N81574 R_NOISELESS 100 / R_U3_R81     U3_V12 U3_N81664 R_NOISELESS 100 / R_U3_R82     U3_N81756 MID R_NOISELESS 1 / R_U3_R83     U3_N81756 U3_SW_OL3 R_NOISELESS 100 / R_U3_R84     U3_N158495 U3_VCLP3 R_NOISELESS 100 / R_U3_R85     U3_N542815 U3_N39920 R_NOISELESS 300MEG / R_U3_R86     U3_N542865 U3_N542815 R_NOISELESS 100MEG / R_U3_R87     MID U3_N542853 R_NOISELESS 1 / R_U3_R88     U3_N546001 U3_N542853 R_NOISELESS 300MEG / R_U3_R89     U3_N546055 U3_N546001 R_NOISELESS 100MEG / R_U3_R90     MID U3_N546017 R_NOISELESS 1 / R_U3_R91     U3_N1017618 MID R_NOISELESS 1 / R_U3_R92     U3_N1017680 MID R_NOISELESS 1 / R_U3_RDUMMY_3 MID U3_N45999 R_NOISELESS 10K / R_U3_RX_3    U3_N45999 U3_N46041 R_NOISELESS 100K / R_U3_RX1     MID U3_N161737 R_NOISELESS 1G / R_U3_RX2     U3_VIMON3 U3_N161737 R_NOISELESS 100 / R_U3_RX3     MID U3_N161937 R_NOISELESS 1G / R_U3_RX4     U3_VOUT_S3 U3_N161937 R_NOISELESS 100 / V_U3_V_GRN   U3_N65737 MID -62 / V_U3_V_GRP   U3_N65567 MID 62 / V_U3_V_ISCN  U3_N59905 MID -18 / V_U3_V_ISCP  U3_N59739 MID 18 / V_U3_V_ORN3  U3_N1017606 U3_VCLP3 -450M / V_U3_V_ORP3  U3_N1017700 U3_VCLP3 450M / V_U3_VCM_MAX U3_N31389 VCC_B -1.5 / V_U3_VCM_MIN U3_N31737 VEE_B 0.2 / V_V_OSN      N360200 N360124 0 / V_VB         VCC_B N365895 1 / V_VCM_MAX    N363059 VCC_B -2 / V_VCM_MAX1   N364388 VCC_B -2 / V_VCM_MIN    N363261 VEE_B 2 / V_VCM_MIN1   N364590 VEE_B 2 / X_S1         N359954 VCC N359954 VCC BLOCK_DC_S1_INA819 / X_S5         VEE N359954 VEE N359954 BLOCK_DC_S5_INA819 / X_S6         N360124 VCC N360124 VCC BLOCK_DC_S6_INA819 / X_S7         VEE N360124 VEE N360124 BLOCK_DC_S7_INA819 / X_S8         OUT VCC OUT VCC BLOCK_DC_S8_INA819 / X_S9         VEE OUT VEE OUT BLOCK_DC_S9_INA819 / X_S10        REF VCC REF VCC BLOCK_DC_S10_INA819 / X_S11        VEE REF VEE REF BLOCK_DC_S11_INA819 / X_S12        RG- VCC RG- VCC BLOCK_DC_S12_INA819 / X_S13        VEE RG- VEE RG- BLOCK_DC_S13_INA819 / X_S14        RG+ VCC RG+ VCC BLOCK_DC_S14_INA819 / X_S15        VEE RG+ VEE RG+ BLOCK_DC_S15_INA819 / X_U1_H1      U1_N234424 NODE1 U1_N963303 MID A1_IN_AMP_U1_H1_INA819 / X_U1_U26     U1_VIMON1 MID MID VCC IQ_SRC_INA819 PARAMS: GAIN=1E-3 / X_U1_U27     MID U1_VIMON1 VEE MID IQ_SRC_INA819 PARAMS: GAIN=1E-3 / X_U1_U30     N365895 N365868 MID U1_N918063 AOL_1_INA819 PARAMS: GAIN=1E-4 IPOS=.5 INEG=-.5 / X_U1_U31     U1_N918063 MID MID U1_N918081 AOL_2_IN_INA819 PARAMS: GAIN=0.1234 IPOS=10 INEG=-10 / X_U2_H1      U2_N234424 NODE2 U2_N963303 MID A2_IN_AMP_U2_H1_INA819 / X_U2_U26     U2_VIMON2 MID MID VCC IQ_SRC_INA819 PARAMS: GAIN=1E-3 / X_U2_U27     MID U2_VIMON2 VEE MID IQ_SRC_INA819 PARAMS: GAIN=1E-3 / X_U2_U30     N365895 N365907 MID U2_N971041 AOL_1_INA819 PARAMS: GAIN=1E-4 IPOS=.5 INEG=-.5 / X_U2_U31     U2_N971041 MID MID U2_N918081 AOL_2_IN_INA819 PARAMS: GAIN=0.1234 IPOS=10 INEG=-10 / X_U3_H1      U3_N45999 N373869 U3_N161737 MID OUT_AMP_U3_H1_INA819 / X_U3_H4      U3_N1017338 U3_N1017618 U3_V11 MID OUT_AMP_U3_H4_INA819 / X_U3_H5      U3_N1017378 U3_N1017680 U3_V12 MID OUT_AMP_U3_H5_INA819 / X_U3_S3      U3_N1017338 U3_CLAMP3 U3_N1017338 U3_CLAMP3 OUT_AMP_U3_S3_INA819 / X_U3_S4      U3_CLAMP3 U3_N1017378 U3_CLAMP3 U3_N1017378 OUT_AMP_U3_S4_INA819 / X_U3_U4      U3_N25435 U3_N24207 VOS_DRIFT_INA819 PARAMS: DC=10.09E-06 POL=1 DRIFT=2.5E-6 / X_U3_U6      U3_N28678 MID U3_N32236 MID U3_N31389 U3_N31737 VCM_CLAMP_INA819 PARAMS: GAIN=1 / X_U3_U10     U3_VCC_CLP3 U3_VEE_CLP3 U3_VOUT_S3 MID U3_N55560 U3_N57321 CLAMP_AMP_LO_INA819 PARAMS: G=1 / X_U3_U11     U3_N59739 U3_N59905 U3_VIMON3 MID U3_N59743 U3_N59881 CLAMP_AMP_LO_INA819 PARAMS: G=1 / X_U3_U12     U3_N65567 U3_N65737 U3_N68774 MID U3_N65575 U3_N65713 CLAMP_AMP_HI_INA819 PARAMS: G=10 / X_U3_U17     MID U3_N81756 U3_N81574 U3_N81664 OL_SENSE_INA819 / X_U3_U18     U3_VIMON3 MID U3_N72064 VCC_B CLAWP_INA819 / X_U3_U19     MID U3_VIMON3 VEE_B U3_N72073 CLAWN_INA819 / X_U3_U22     U3_N59747 U3_N59865 U3_CL_CLAMP3 MID CL_SRC_INA819 PARAMS: GAIN=1 IPOS=0.246 INEG=-0.246 / X_U3_U23     U3_N65579 U3_N65697 U3_CLAMP3 MID GR_SRC_INA819 PARAMS: GAIN=1 IPOS=1.18 INEG=-1.18 / X_U3_U25     U3_SW_OL3 MID U3_N37029 U3_N37037 SW_OL_INA819 / X_U3_U26     U3_VIMON3 MID MID VCC IQ_SRC_INA819 PARAMS: GAIN=1E-3 / X_U3_U27     MID U3_VIMON3 VEE MID IQ_SRC_INA819 PARAMS: GAIN=1E-3 / X_U3_U30     U3_N32347 U3_N31303 MID U3_N32510 AOL_1_INA819 PARAMS: GAIN=1E-4 IPOS=.5 INEG=-.5 / X_U3_U31     U3_N32510 MID MID U3_CLAMP3 AOL_2_INA819 PARAMS: GAIN=0.1234 IPOS=0.59 INEG=-0.59 / X_U3_U32     U3_N39892 MID MID U3_N46041 ZO_SRC_INA819 PARAMS: GAIN=11764.7 IPOS=3.6E3 INEG=-3.6E3 / X_U3_U35     U3_N56849 U3_N57325 U3_CLAW_CLAMP3 MID CLAW_SRC_INA819 PARAMS: GAIN=1 IPOS=0.123 INEG=-0.123 / X_U3_U36     U3_N23567 U3_N24207 VNSE_INA819 / X_U4         N359958 N359966 VOS_DRIFT_IN_INA819 PARAMS: DC=10E-06 POL=1 DRIFT=0.4E-6 / X_U6         N363177 MID N363141 MID N363059 N363261 VCM_CLAMP_INA819 PARAMS: GAIN=1 / X_U16        MID OUT N372587 GAIN_S GAIN_SENSE_INA819 / X_U38        N359954 N359966 VNSE_IN_INA819 / X_U39        N364506 MID N364470 MID N364388 N364590 VCM_CLAMP_INA819 PARAMS: GAIN=1 / X_U40        GAIN_S MID N375473 REF R_CMRR_INA819 / X_U41        N359966 MID FEMT_INA819 / X_U42        N360124 MID FEMT_INA819 / .MODEL R_NOISELESS RES (T_ABS=-273.15) / .ENDS INA819</Text> / <Dependency>0\block_dc_s7_ina819</Dependency> / <Dependency>0\block_dc_s1_ina819</Dependency> / <Dependency>0\block_dc_s5_ina819</Dependency> / <Dependency>0\block_dc_s8_ina819</Dependency> / <Dependency>0\block_dc_s6_ina819</Dependency> / <Dependency>0\block_dc_s9_ina819</Dependency> / <Dependency>0\block_dc_s10_ina819</Dependency> / <Dependency>0\block_dc_s11_ina819</Dependency> / <Dependency>0\block_dc_s12_ina819</Dependency> / <Dependency>0\block_dc_s13_ina819</Dependency> / <Dependency>0\block_dc_s14_ina819</Dependency> / <Dependency>0\block_dc_s15_ina819</Dependency> / <Dependency>0\a1_in_amp_u1_h1_ina819</Dependency> / <Dependency>0\vcm_clamp_ina819</Dependency> / <Dependency>0\iq_src_ina819</Dependency> / <Dependency>0\aol_1_ina819</Dependency> / <Dependency>0\aol_2_in_ina819</Dependency> / <Dependency>0\cl_src_ina819</Dependency> / <Dependency>0\a2_in_amp_u2_h1_ina819</Dependency> / <Dependency>0\vnse_ina819</Dependency> / <Dependency>0\out_amp_u3_h1_ina819</Dependency> / <Dependency>0\out_amp_u3_h4_ina819</Dependency> / <Dependency>0\out_amp_u3_h5_ina819</Dependency> / <Dependency>0\out_amp_u3_s3_ina819</Dependency> / <Dependency>0\out_amp_u3_s4_ina819</Dependency> / <Dependency>0\clawn_ina819</Dependency> / <Dependency>0\vos_drift_ina819</Dependency> / <Dependency>0\clamp_amp_lo_ina819</Dependency> / <Dependency>0\clamp_amp_hi_ina819</Dependency> / <Dependency>0\ol_sense_ina819</Dependency> / <Dependency>0\clawp_ina819</Dependency> / <Dependency>0\gr_src_ina819</Dependency> / <Dependency>0\sw_ol_ina819</Dependency> / <Dependency>0\vos_drift_in_ina819</Dependency> / <Dependency>0\aol_2_ina819</Dependency> / <Dependency>0\zo_src_ina819</Dependency> / <Dependency>0\claw_src_ina819</Dependency> / <Dependency>0\gain_sense_ina819</Dependency> / <Dependency>0\vnse_in_ina819</Dependency> / <Dependency>0\r_cmrr_ina819</Dependency> / <Dependency>0\femt_ina819</Dependency> / </Model> / </CacheFrame> / </root>
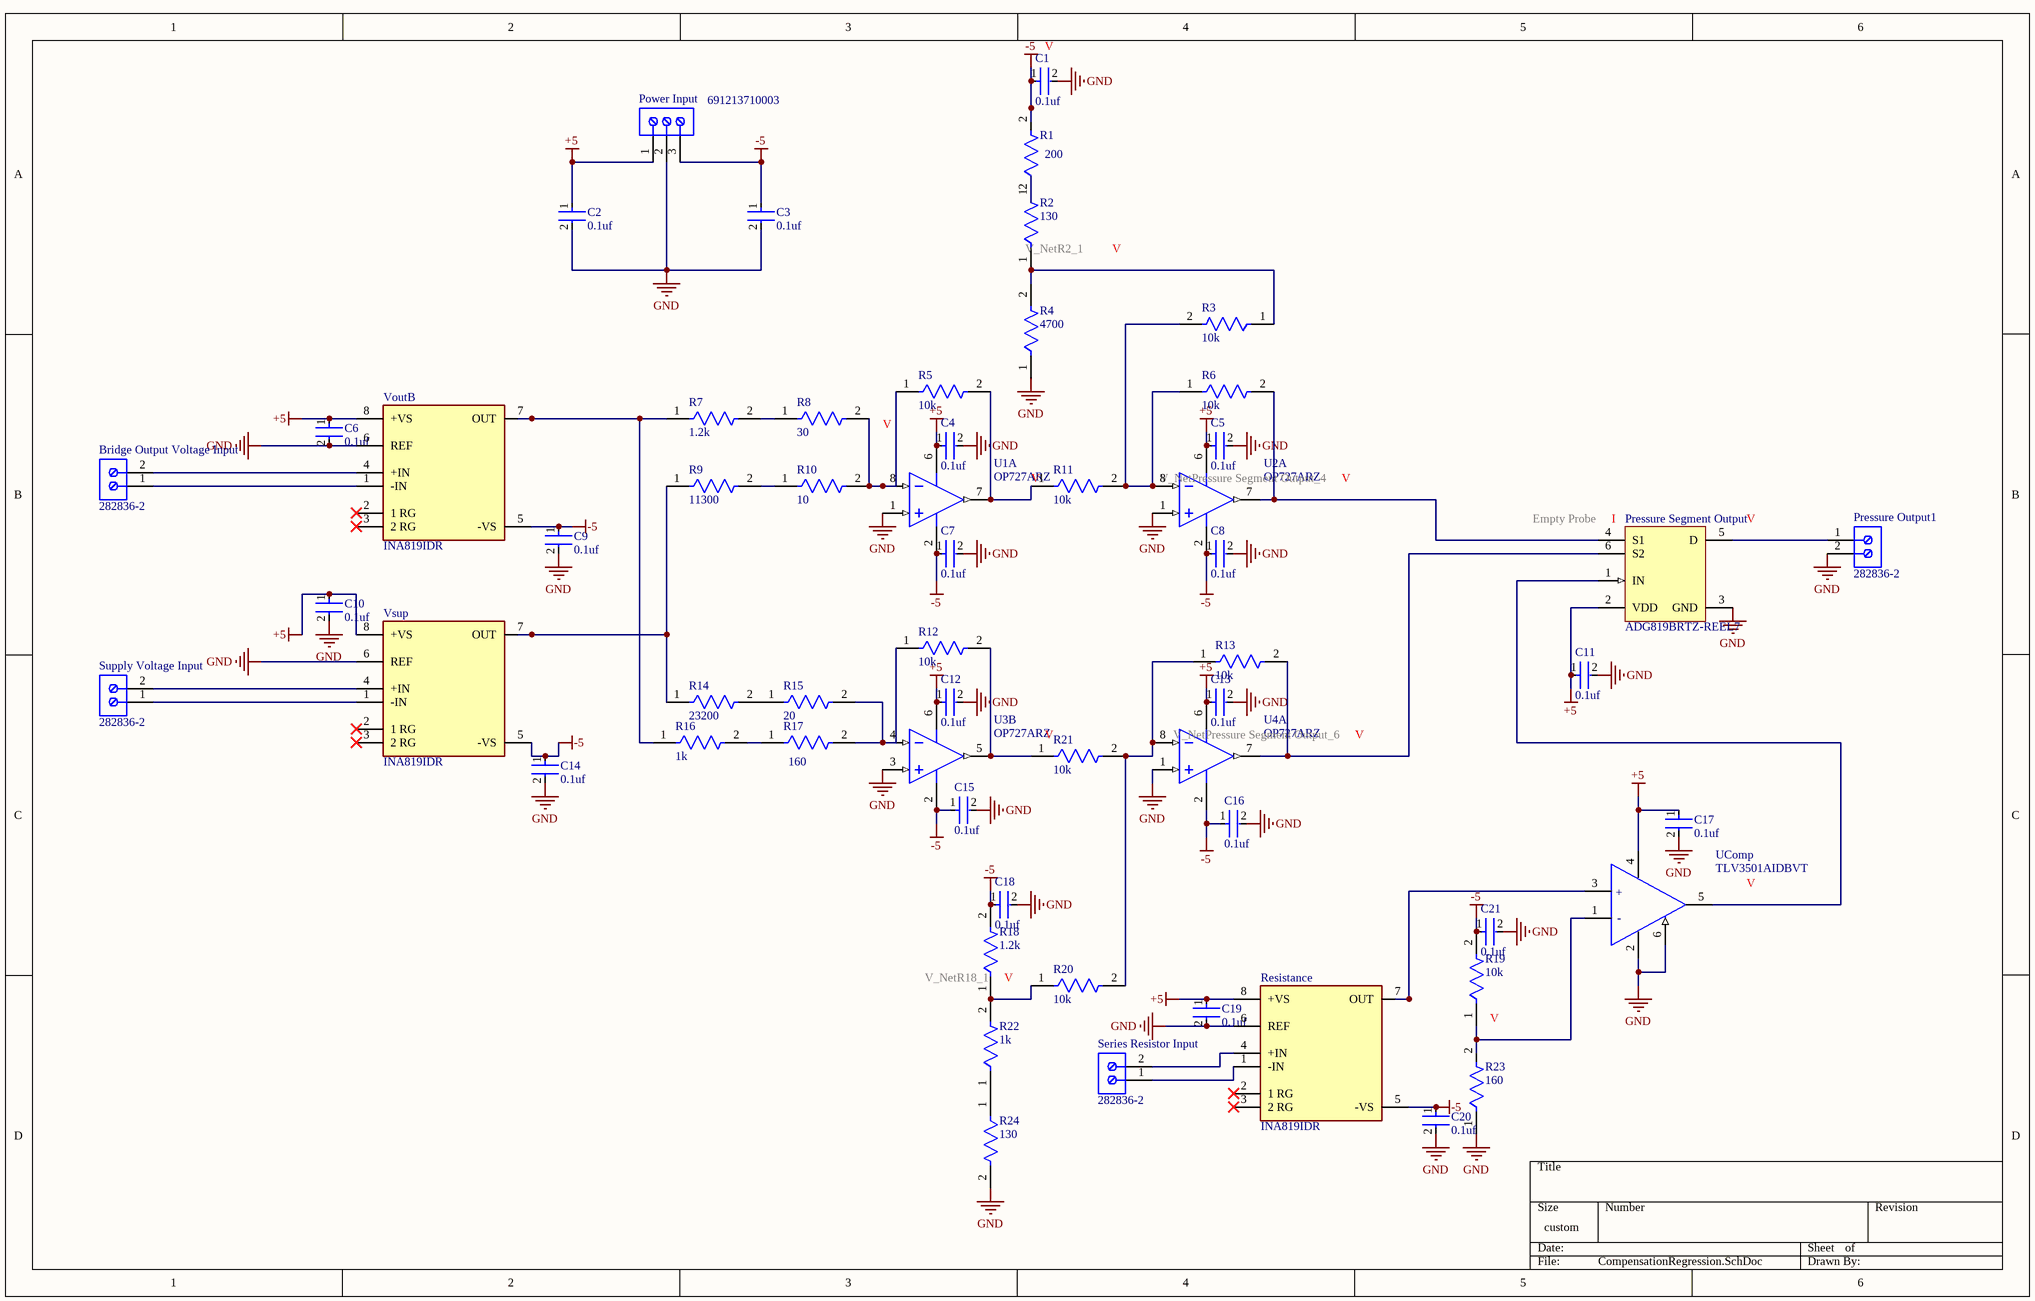
[diagram p0: CompensationRegression.SchDoc]

## Parts
Bridge_Output_Voltage_Input  282836-2  [TECO-282836-2_V]
C1  0.1uf  [FP-C0603C-CF-MFG]
C2  0.1uf  [FP-C0603C-CF-MFG]
C3  0.1uf  [FP-C0603C-CF-MFG]
C4  0.1uf  [FP-C0603C-CF-MFG]
C5  0.1uf  [FP-C0603C-CF-MFG]
C6  0.1uf  [FP-C0603C-CF-MFG]
C7  0.1uf  [FP-C0603C-CF-MFG]
C8  0.1uf  [FP-C0603C-CF-MFG]
C9  0.1uf  [FP-C0603C-CF-MFG]
C10  0.1uf  [FP-C0603C-CF-MFG]
C11  0.1uf  [FP-C0603C-CF-MFG]
C12  0.1uf  [FP-C0603C-CF-MFG]
C13  0.1uf  [FP-C0603C-CF-MFG]
C14  0.1uf  [FP-C0603C-CF-MFG]
C15  0.1uf  [FP-C0603C-CF-MFG]
C16  0.1uf  [FP-C0603C-CF-MFG]
C17  0.1uf  [FP-C0603C-CF-MFG]
C18  0.1uf  [FP-C0603C-CF-MFG]
C19  0.1uf  [FP-C0603C-CF-MFG]
C20  0.1uf  [FP-C0603C-CF-MFG]
C21  0.1uf  [FP-C0603C-CF-MFG]
Power_Input  691213710003  [691213710003]
Pressure_Output1  282836-2  [TECO-282836-2_V]
Pressure_Segment_Output  ADG819BRTZ-REEL7  [ADI-RJ-6_N]
R1  200  [FP-CRCW0603-e3-MFG]
R2  130  [FP-CRCW0603-e3-MFG]
R3  10k  [FP-RT0603-MFG]
R4  4700  [FP-MCT0603-MFG]
R5  10k  [FP-RT0603-MFG]
R6  10k  [FP-RT0603-MFG]
R7  1.2k  [FP-RG1005-IPC_A]
R8  30  [FP-CRCW0805-e3-MFG]
R9  11300  [FP-RP73P-1E-MFG]
R10  10  [FP-CRCW0603-e3-IPC_A]
R11  10k  [FP-RT0603-MFG]
R12  10k  [FP-RT0603-MFG]
R13  10k  [FP-RT0603-MFG]
R14  23200  [FP-CRCW0603-e3-IPC_A]
R15  20  [FP-CRCW0402-e3-IPC_C]
R16  1k  [FP-CRCW0402-e3-MFG]
R17  160  [FP-CRCW0402-e3-IPC_B]
R18  1.2k  [FP-RG1005-IPC_A]
R19  10k  [FP-RT0603-MFG]
R20  10k  [FP-RT0603-MFG]
R21  10k  [FP-RT0603-MFG]
R22  1k  [FP-CRCW0402-e3-MFG]
R23  160  [FP-CRCW0402-e3-IPC_B]
R24  130  [FP-CRCW0603-e3-MFG]
Resistance  INA819IDR  [FP-D0008A-MFG]
Series_Resistor_Input  282836-2  [TECO-282836-2_V]
Supply_Voltage_Input  282836-2  [TECO-282836-2_V]
U1  OP727ARZ  [ADI-R-8_L]  (part A of 2)
U2  OP727ARZ  [ADI-R-8_L]  (part A of 2)
U3  OP727ARZ  [ADI-R-8_L]  (part B of 2)
U4  OP727ARZ  [ADI-R-8_L]  (part A of 2)
UComp  TLV3501AIDBVT  [FP-DBV0006A-MFG]
VoutB  INA819IDR  [FP-D0008A-MFG]
Vsup  INA819IDR  [FP-D0008A-MFG]

## Nets
+5: C2.1 C4.1 C5.1 C6.1 C10.1 C11.1 C12.1 C13.1 C17.1 C19.1 Power_Input.1 Pressure_Segment_Output.2(VDD) Resistance.8(+VS) U1.6(+V) U2.6(+V) U3.6(+V) U4.6(+V) UComp.4(V+) VoutB.8(+VS) Vsup.8(+VS)
-5: C1.1 C3.1 C7.1 C8.1 C9.1 C14.1 C15.1 C16.1 C18.1 C20.1 C21.1 Power_Input.3 R1.2 R18.2 R19.2 Resistance.5(-VS) U1.2(-V) U2.2(-V) U3.2(-V) U4.2(-V) VoutB.5(-VS) Vsup.5(-VS)
GND: C1.2 C2.2 C3.2 C4.2 C5.2 C6.2 C7.2 C8.2 C9.2 C10.2 C11.2 C12.2 C13.2 C14.2 C15.2 C16.2 C17.2 C18.2 C19.2 C20.2 C21.2 Power_Input.2 Pressure_Output1.2 Pressure_Segment_Output.3(GND) R4.1 R23.1 R24.2 Resistance.6(REF) U1.1(+IN_A) U2.1(+IN_A) U3.3(+IN_B) U4.1(+IN_A) UComp.2(V-) UComp.6(SHDN) VoutB.6(REF) Vsup.6(REF)
NetBridge_Output_Voltage_Input_1: Bridge_Output_Voltage_Input.1 VoutB.1(-IN)
NetBridge_Output_Voltage_Input_2: Bridge_Output_Voltage_Input.2 VoutB.4(+IN)
NetPressure_Output1_1: Pressure_Output1.1 Pressure_Segment_Output.5(D)
NetPressure_Segment_Output_1: Pressure_Segment_Output.1(IN) UComp.5(OUT)
NetPressure_Segment_Output_4: Pressure_Segment_Output.4(S1) R6.2 U2.7(OUT_A)
NetPressure_Segment_Output_6: Pressure_Segment_Output.6(S2) R13.2 U4.7(OUT_A)
NetR1_1: R1.1 R2.2
NetR2_1: R2.1 R3.1 R4.2
NetR3_2: R3.2 R6.1 R11.2 U2.8(-IN_A)
NetR5_1: R5.1 R8.2 R10.2 U1.8(-IN_A)
NetR5_2: R5.2 R11.1 U1.7(OUT_A)
NetR7_1: R7.1 R16.1 VoutB.7(OUT)
NetR7_2: R7.2 R8.1
NetR9_1: R9.1 R14.1 Vsup.7(OUT)
NetR9_2: R9.2 R10.1
NetR12_1: R12.1 R15.2 R17.2 U3.4(-IN_B)
NetR12_2: R12.2 R21.1 U3.5(OUT_B)
NetR13_1: R13.1 R20.2 R21.2 U4.8(-IN_A)
NetR14_2: R14.2 R15.1
NetR16_2: R16.2 R17.1
NetR18_1: R18.1 R20.1 R22.2
NetR19_1: R19.1 R23.2 UComp.1(-IN)
NetR22_1: R22.1 R24.1
NetResistance_1: Resistance.1(-IN) Series_Resistor_Input.1
NetResistance_4: Resistance.4(+IN) Series_Resistor_Input.2
NetResistance_7: Resistance.7(OUT) UComp.3(+IN)
NetSupply_Voltage_Input_1: Supply_Voltage_Input.1 Vsup.1(-IN)
NetSupply_Voltage_Input_2: Supply_Voltage_Input.2 Vsup.4(+IN)

Not connected (* = marked no-connect by the designer): Resistance 2(1_RG)* 3(2_RG)*; VoutB 2(1_RG)* 3(2_RG)*; Vsup 2(1_RG)* 3(2_RG)*